# Altium schematic sheet MCU_Sheet1.SchDoc
size A4; SheetNumber: 1; SheetTotal: 11
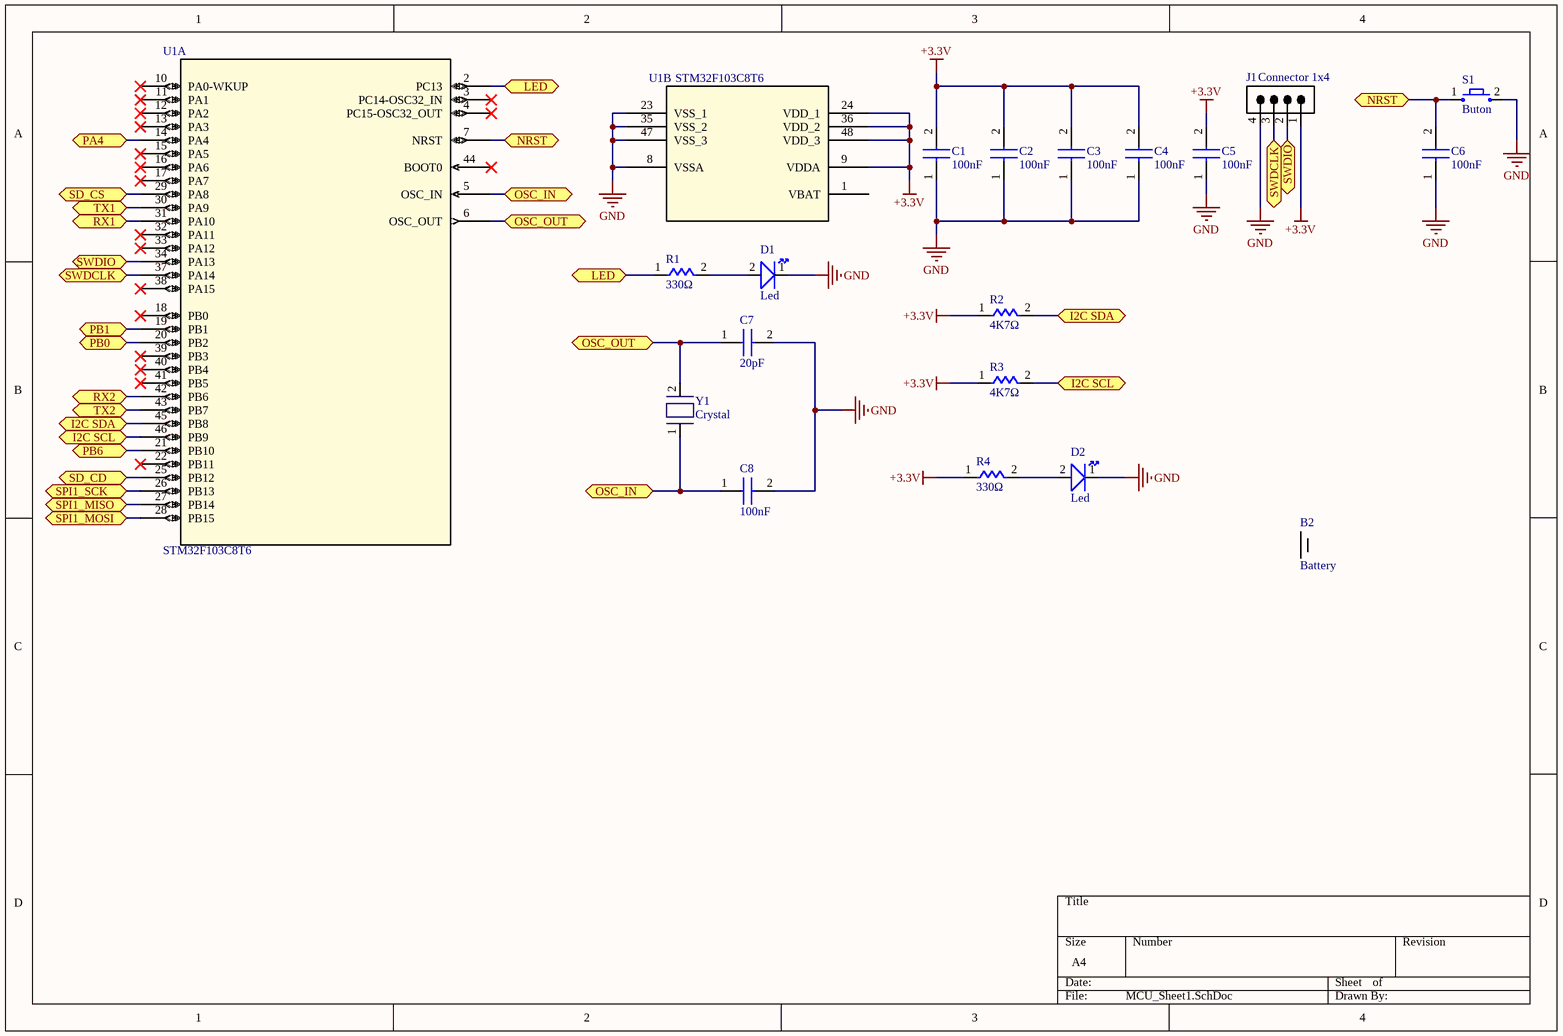
[diagram p0: MCU_Sheet1.SchDoc]

## Parts
B2  Battery  [Lityum Battery]
C1  100nF  [CAP - 0603]
C2  100nF  [CAP - 0603]
C3  100nF  [CAP - 0603]
C4  100nF  [CAP - 0603]
C5  100nF  [CAP - 0603]
C6  100nF  [CAP - 0603]
C7  20pF  [CAP - 0603]
C8  100nF  [CAP - 0603]
D1  Led  [LED - 0603]
D2  Led  [LED - 0603]
J1  Connector 1x4  [Connector 1x4]
R1  330Ω  [RES - 0603]
R2  4K7Ω  [RES - 0603]
R3  4K7Ω  [RES - 0603]
R4  330Ω  [RES - 0603]
S1  Buton  [Button - DTSMF31RVTR]
U1  STM32F103C8T6  [LQFP48]  (parts A,B of 2)
Y1  Crystal  [Crystal - HC-49S SMD]

## Ports
I2C SCL (bidir), I2C SDA (bidir), LED (bidir), NRST (bidir), OSC_IN (bidir), OSC_OUT (bidir), PA4 (bidir), PB0 (bidir), PB1 (bidir), PB6 (bidir), RX1 (bidir), RX2 (bidir), SD_CD (bidir), SD_CS (bidir), SPI1_MISO (bidir), SPI1_MOSI (bidir), SPI1_SCK (bidir), SWDCLK (bidir), SWDIO (bidir), TX1 (bidir), TX2 (bidir)

## Nets
+3.3V: C1.2 C2.2 C3.2 C4.2 C5.2 J1.1 R2.1 R3.1 R4.1 U1.9(VDDA) U1.24(VDD_1) U1.36(VDD_2) U1.48(VDD_3)
GND: C1.1 C2.1 C3.1 C4.1 C5.1 C6.1 C7.2 C8.2 D1.1 D2.1 J1.4 S1.2 U1.8(VSSA) U1.23(VSS_1) U1.35(VSS_2) U1.47(VSS_3)
I2C SCL: R3.2 U1.46(PB9) ; port I2C SCL
I2C SDA: R2.2 U1.45(PB8) ; port I2C SDA
LED: R1.1 U1.2(PC13) ; port LED
NRST: C6.2 S1.1 U1.7(NRST) ; port NRST
OSC_IN: C8.1 U1.5(OSC_IN) Y1.1 ; port OSC_IN
OSC_OUT: C7.1 U1.6(OSC_OUT) Y1.2 ; port OSC_OUT
PA4: U1.14(PA4) ; port PA4
PB0: U1.20(PB2) ; port PB0
PB1: U1.19(PB1) ; port PB1
PB6: U1.21(PB10) ; port PB6
RX1: U1.31(PA10) ; port RX1
RX2: U1.42(PB6) ; port RX2
SD_CD: U1.25(PB12) ; port SD_CD
SD_CS: U1.29(PA8) ; port SD_CS
SPI1_MISO: U1.27(PB14) ; port SPI1_MISO
SPI1_MOSI: U1.28(PB15) ; port SPI1_MOSI
SPI1_SCK: U1.26(PB13) ; port SPI1_SCK
SWDCLK: J1.3 U1.37(PA14) ; port SWDCLK
SWDIO: J1.2 U1.34(PA13) ; port SWDIO
TX1: U1.30(PA9) ; port TX1
TX2: U1.43(PB7) ; port TX2
NetD1_2: D1.2 R1.2
NetD2_2: D2.2 R4.2

Not connected (* = marked no-connect by the designer): U1 1(VBAT) 3(PC14-OSC32_IN)* 4(PC15-OSC32_OUT)* 10(PA0-WKUP)* 11(PA1)* 12(PA2)* 13(PA3)* 15(PA5)* 16(PA6)* 17(PA7)* 18(PB0)* 22(PB11)* 32(PA11)* 33(PA12)* 38(PA15)* 39(PB3)* 40(PB4)* 41(PB5)* 44(BOOT0)*

## Library data of the parts
C1-C8 = CAP: Capacitor; ComponentLink1Description: Satın Alma Linki; ComponentLink1URL: https://ozdisan.com/pasif-komponentler/kondansatorler/smt-smd-ve-mlcc-kondansatorler/CL10B472KB8NNNC; ComponentLink2Description: Satın Alma Linki; ComponentLink2URL: https://ozdisan.com/pasif-komponentler/kondansatorler/smt-smd-ve-mlcc-kondansatorler/CL10C200JB8NNNC; ComponentLink3Description: Satın Alma Linki; ComponentLink3URL: https://ozdisan.com/pasif-komponentler/kondansatorler/smt-smd-ve-mlcc-kondansatorler/CL10B104KB8NNNC; ComponentLink4Description: Datasheet; ComponentLink4URL: https://cdn.ozdisan.com/ETicaret_Dosya/448212_5798276.PDF; ComponentLink5Description: Satın Alma Linki; ComponentLink5URL: https://ozdisan.com/pasif-komponentler/kondansatorler/smt-smd-ve-mlcc-kondansatorler/CL10C101JB8NNNC
D1 D2 = Led: HL-PST-1608U51GC - LED SMD 0603 GREEN 500mcd 120° WATER CLEAR; ComponentLink1Description: Satın Alma Linki; ComponentLink1URL: https://ozdisan.com/Product/Detail/471660/HL-PST-1608U51GC; ComponentLink2Description: Datasheet; ComponentLink2URL: https://cdn.ozdisan.com/ETicaret_Dosya/471660_7204356.pdf
J1 = Connector 1x4: MOLEX-705530003 - CONNECTOR HEADER 2.54MM 4P 90C GOLD; ComponentLink1Description: Datasheet; ComponentLink1URL: https://www.molex.com/pdm_docs/sd/705530003_sd.pdf; ComponentLink2Description: Satın Alma Linki; ComponentLink2URL: https://www.ozdisan.com/konnektor-ve-baglanti-elemanlari/konnektor-cesitleri/pcb-konnektorler/MOLEX-705530003
R1-R4 = Res: SMD Res; ComponentLink1Description: Datasheet; ComponentLink1URL: https://cdn.ozdisan.com/ETicaret_Dosya/570122_9878629.pdf; ComponentLink2Description: Satın Alma Linki; ComponentLink2URL: https://www.ozdisan.com/pasif-komponentler/direncler/smt-smd-direncler/TC0325B3301T5C; ComponentLink3Description: Satın Alma Linki; ComponentLink3URL: https://ozdisan.com/pasif-komponentler/direncler/smt-smd-ve-cip-direncler/0603SAF4701T5E; ComponentLink4Description: Satın Alma Linki; ComponentLink4URL: https://ozdisan.com/pasif-komponentler/direncler/smt-smd-ve-cip-direncler/0805S8F604JT5E; ComponentLink5Description: Satın Alma Linki; ComponentLink5URL: https://ozdisan.com/pasif-komponentler/direncler/smt-smd-ve-cip-direncler/0603SAF1022T5E; ComponentLink6Description: Satın Alma Linki; ComponentLink6URL: https://www.ozdisan.com/pasif-komponentler/direncler/smt-smd-direncler/CQ03SAF0000T5E
S1 = Buton: DTSMF-31R-V-T/R - SWITCH TACT 6.00x3.50 4.30mm 260gF SMT V/T; ComponentLink1Description: Satın Alma Linki; ComponentLink1URL: https://ozdisan.com/Product/Detail/354235/DTSMF-31R-V-TR; ComponentLink2Description: Datasheet; ComponentLink2URL: https://cdn.ozdisan.com/ETicaret_Dosya/485632_396522.pdf
U1 = STM32F103C8T6: Microcontroller; Mfr_Name: STMicroelectronics; Copyright: Copyright (C) 2021 Ultra Librarian. All rights reserved.; Manufacturer_Part_Number: STM32F103C8T6; RefDes: RefDes; Type: DEV
Y1 = Crystal: AS-8.000-18-SMD-TR - CRYSTAL 8.0000MHZ 18PF SMD; ComponentLink1Description: Satın Alma Linki; ComponentLink1URL: https://ozdisan.com/pasif-komponentler/kristaller-osilatorler-ve-rezanatorler/kristaller/AS-8-000-18-SMD-TR; ComponentLink2Description: Datasheet; ComponentLink2URL: https://cdn.ozdisan.com/ETicaret_Dosya/40505_2732396.pdf
B2 = Battery: ComponentLink1Description: Satın Alma Linki; ComponentLink1URL: https://www.gittigidiyor.com/bilgisayar-tablet/12v-2-6a-lityum-batarya_pdp_728518934